# Altium project ts_20-Test-Looms.PrjPcb
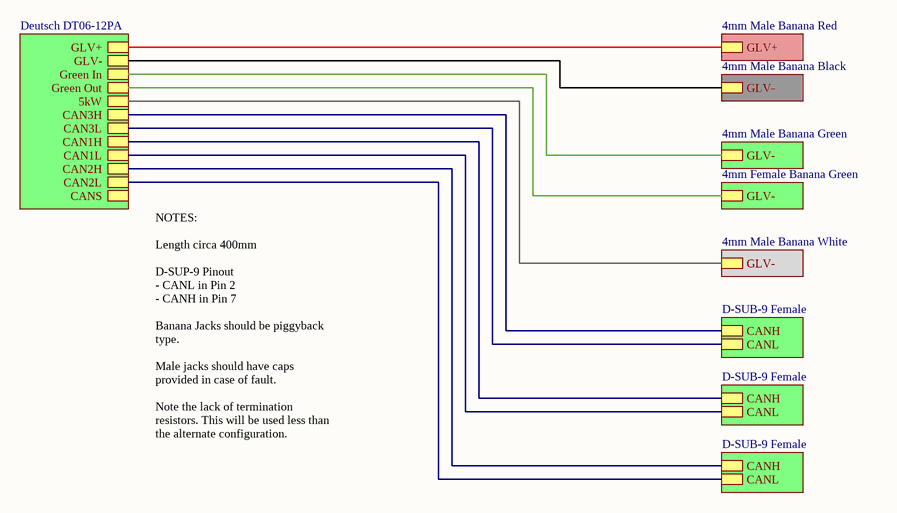
[diagram p0: Tester Harness.SchDoc]
3 sheets, 3 parts. Net scope: hierarchical (ports join the sheet entries above them; power ports are global).
Sheets:
  Tester Harness.SchDoc
  Piggyback Harness.SchDoc
  Termination Resistor.SchDoc

## Sheet Tester Harness.SchDoc
size A4

### Sub-sheets
4mm Female Banana Green = File Name (file not in this document): GLV-
4mm Male Banana Black = File Name (file not in this document): GLV-
4mm Male Banana Green = File Name (file not in this document): GLV-
4mm Male Banana Red = File Name (file not in this document): GLV+
4mm Male Banana White = File Name (file not in this document): GLV-
D-SUB-9 Female = File Name (file not in this document): CANH, CANL
D-SUB-9 Female = File Name (file not in this document): CANH, CANL
D-SUB-9 Female = File Name (file not in this document): CANH, CANL
Deutsch DT06-12PA = File Name (file not in this document): GLV+, GLV-, CAN1H, CAN3H, CAN3L, CAN2H, CAN1L, CAN2L, CANS, Green Out, Green In, 5kW

### Nets
(unnamed): sheet Deutsch DT06-12PA/GLV+, sheet 4mm Male Banana Red/GLV+
(unnamed): sheet Deutsch DT06-12PA/GLV-, sheet 4mm Male Banana Black/GLV-
(unnamed): sheet Deutsch DT06-12PA/CAN1H, sheet D-SUB-9 Female/CANH
(unnamed): sheet Deutsch DT06-12PA/CAN3H, sheet D-SUB-9 Female/CANH
(unnamed): sheet Deutsch DT06-12PA/CAN3L, sheet D-SUB-9 Female/CANL
(unnamed): sheet Deutsch DT06-12PA/CAN2H, sheet D-SUB-9 Female/CANH
(unnamed): sheet Deutsch DT06-12PA/CAN1L, sheet D-SUB-9 Female/CANL
(unnamed): sheet Deutsch DT06-12PA/CAN2L, sheet D-SUB-9 Female/CANL
(unnamed): sheet Deutsch DT06-12PA/Green Out, sheet 4mm Female Banana Green/GLV-
(unnamed): sheet Deutsch DT06-12PA/Green In, sheet 4mm Male Banana Green/GLV-
(unnamed): sheet Deutsch DT06-12PA/5kW, sheet 4mm Male Banana White/GLV-

### Notes on the sheet
- NOTES:
  Length circa 400mm
  D-SUP-9 Pinout
  - CANL in Pin 2
  - CANH in Pin 7
  Banana Jacks should be piggyback type.
  Male jacks should have caps provided in case of fault.
  Note the lack of termination resistors. This will be used less than the alternate configuration.

## Sheet Piggyback Harness.SchDoc
size A4
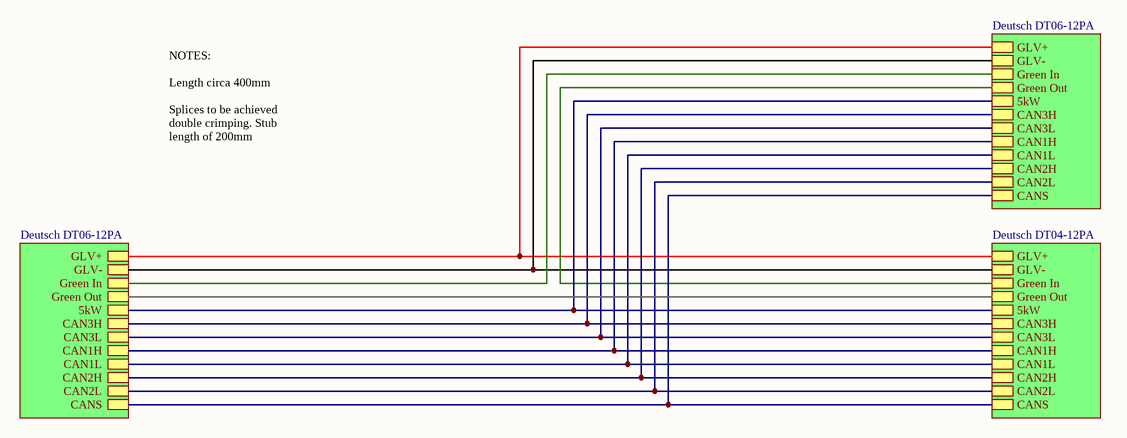
[diagram p1: Piggyback Harness.SchDoc]

### Sub-sheets
Deutsch DT04-12PA = File Name (file not in this document): GLV+, GLV-, CAN1H, CAN3H, CAN3L, CAN2H, CAN1L, CAN2L, CANS, Green Out, Green In, 5kW
Deutsch DT06-12PA = File Name (file not in this document): GLV+, GLV-, CAN1H, CAN3H, CAN3L, CAN2H, CAN1L, CAN2L, CANS, Green Out, Green In, 5kW
Deutsch DT06-12PA = File Name (file not in this document): GLV+, GLV-, CAN1H, CAN3H, CAN3L, CAN2H, CAN1L, CAN2L, CANS, Green Out, Green In, 5kW

### Nets
(unnamed): sheet Deutsch DT06-12PA/GLV+, sheet Deutsch DT04-12PA/GLV+, sheet Deutsch DT06-12PA/GLV+
(unnamed): sheet Deutsch DT06-12PA/GLV-, sheet Deutsch DT04-12PA/GLV-, sheet Deutsch DT06-12PA/GLV-
(unnamed): sheet Deutsch DT06-12PA/CAN1H, sheet Deutsch DT04-12PA/CAN1H, sheet Deutsch DT06-12PA/CAN1H
(unnamed): sheet Deutsch DT06-12PA/CAN3H, sheet Deutsch DT04-12PA/CAN3H, sheet Deutsch DT06-12PA/CAN3H
(unnamed): sheet Deutsch DT06-12PA/CAN3L, sheet Deutsch DT04-12PA/CAN3L, sheet Deutsch DT06-12PA/CAN3L
(unnamed): sheet Deutsch DT06-12PA/CAN2H, sheet Deutsch DT04-12PA/CAN2H, sheet Deutsch DT06-12PA/CAN2H
(unnamed): sheet Deutsch DT06-12PA/CAN1L, sheet Deutsch DT04-12PA/CAN1L, sheet Deutsch DT06-12PA/CAN1L
(unnamed): sheet Deutsch DT06-12PA/CAN2L, sheet Deutsch DT04-12PA/CAN2L, sheet Deutsch DT06-12PA/CAN2L
(unnamed): sheet Deutsch DT06-12PA/CANS, sheet Deutsch DT04-12PA/CANS, sheet Deutsch DT06-12PA/CANS
(unnamed): sheet Deutsch DT06-12PA/Green Out, sheet Deutsch DT04-12PA/Green Out
(unnamed): sheet Deutsch DT06-12PA/Green In, sheet Deutsch DT06-12PA/Green In
(unnamed): sheet Deutsch DT06-12PA/5kW, sheet Deutsch DT04-12PA/5kW, sheet Deutsch DT06-12PA/5kW
(unnamed): sheet Deutsch DT04-12PA/Green In, sheet Deutsch DT06-12PA/Green Out

### Notes on the sheet
- NOTES:
  Length circa 400mm
  Splices to be achieved double crimping. Stub length of 200mm

## Sheet Termination Resistor.SchDoc
size A4
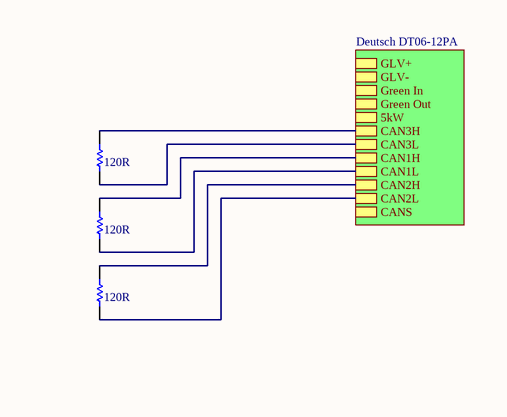
[diagram p2: Termination Resistor.SchDoc, top right]

### Parts
(Parts that share a designator on the sheet are numbered #1, #2 ... from top to bottom, then left to right.)
R?#1  value 120R  [AXIAL-0.3]  (hidden comment: Res1)
R?#2  value 120R  [AXIAL-0.3]  (hidden comment: Res1)
R?#3  value 120R  [AXIAL-0.3]  (hidden comment: Res1)

### Sub-sheets
Deutsch DT06-12PA = File Name (file not in this document): GLV+, GLV-, CAN1H, CAN3H, CAN3L, CAN2H, CAN1L, CAN2L, CANS, Green Out, Green In, 5kW

### Nets
NetR?#1_1: R?#1.1 ; sheet Deutsch DT06-12PA/CAN3L
NetR?#1_2: R?#1.2 ; sheet Deutsch DT06-12PA/CAN3H
NetR?#2_1: R?#2.1 ; sheet Deutsch DT06-12PA/CAN1L
NetR?#2_2: R?#2.2 ; sheet Deutsch DT06-12PA/CAN1H
NetR?#3_1: R?#3.1 ; sheet Deutsch DT06-12PA/CAN2L
NetR?#3_2: R?#3.2 ; sheet Deutsch DT06-12PA/CAN2H

### Library data of the parts
R?#1-R?#3 = Res1: Resistor; Published: 8-Jun-2000; LatestRevisionDate: 17-Jul-2002; LatestRevisionNote: Re-released for DXP Platform.; PackageReference: AXIAL-0.3; Publisher: Altium Limited; PackageDescription: Axial Device, Thru-Hole; 2 Leads; 0.3 in Pin Spacing